# EAGLE schematic ClockGenerator (EAGLE 6.1)
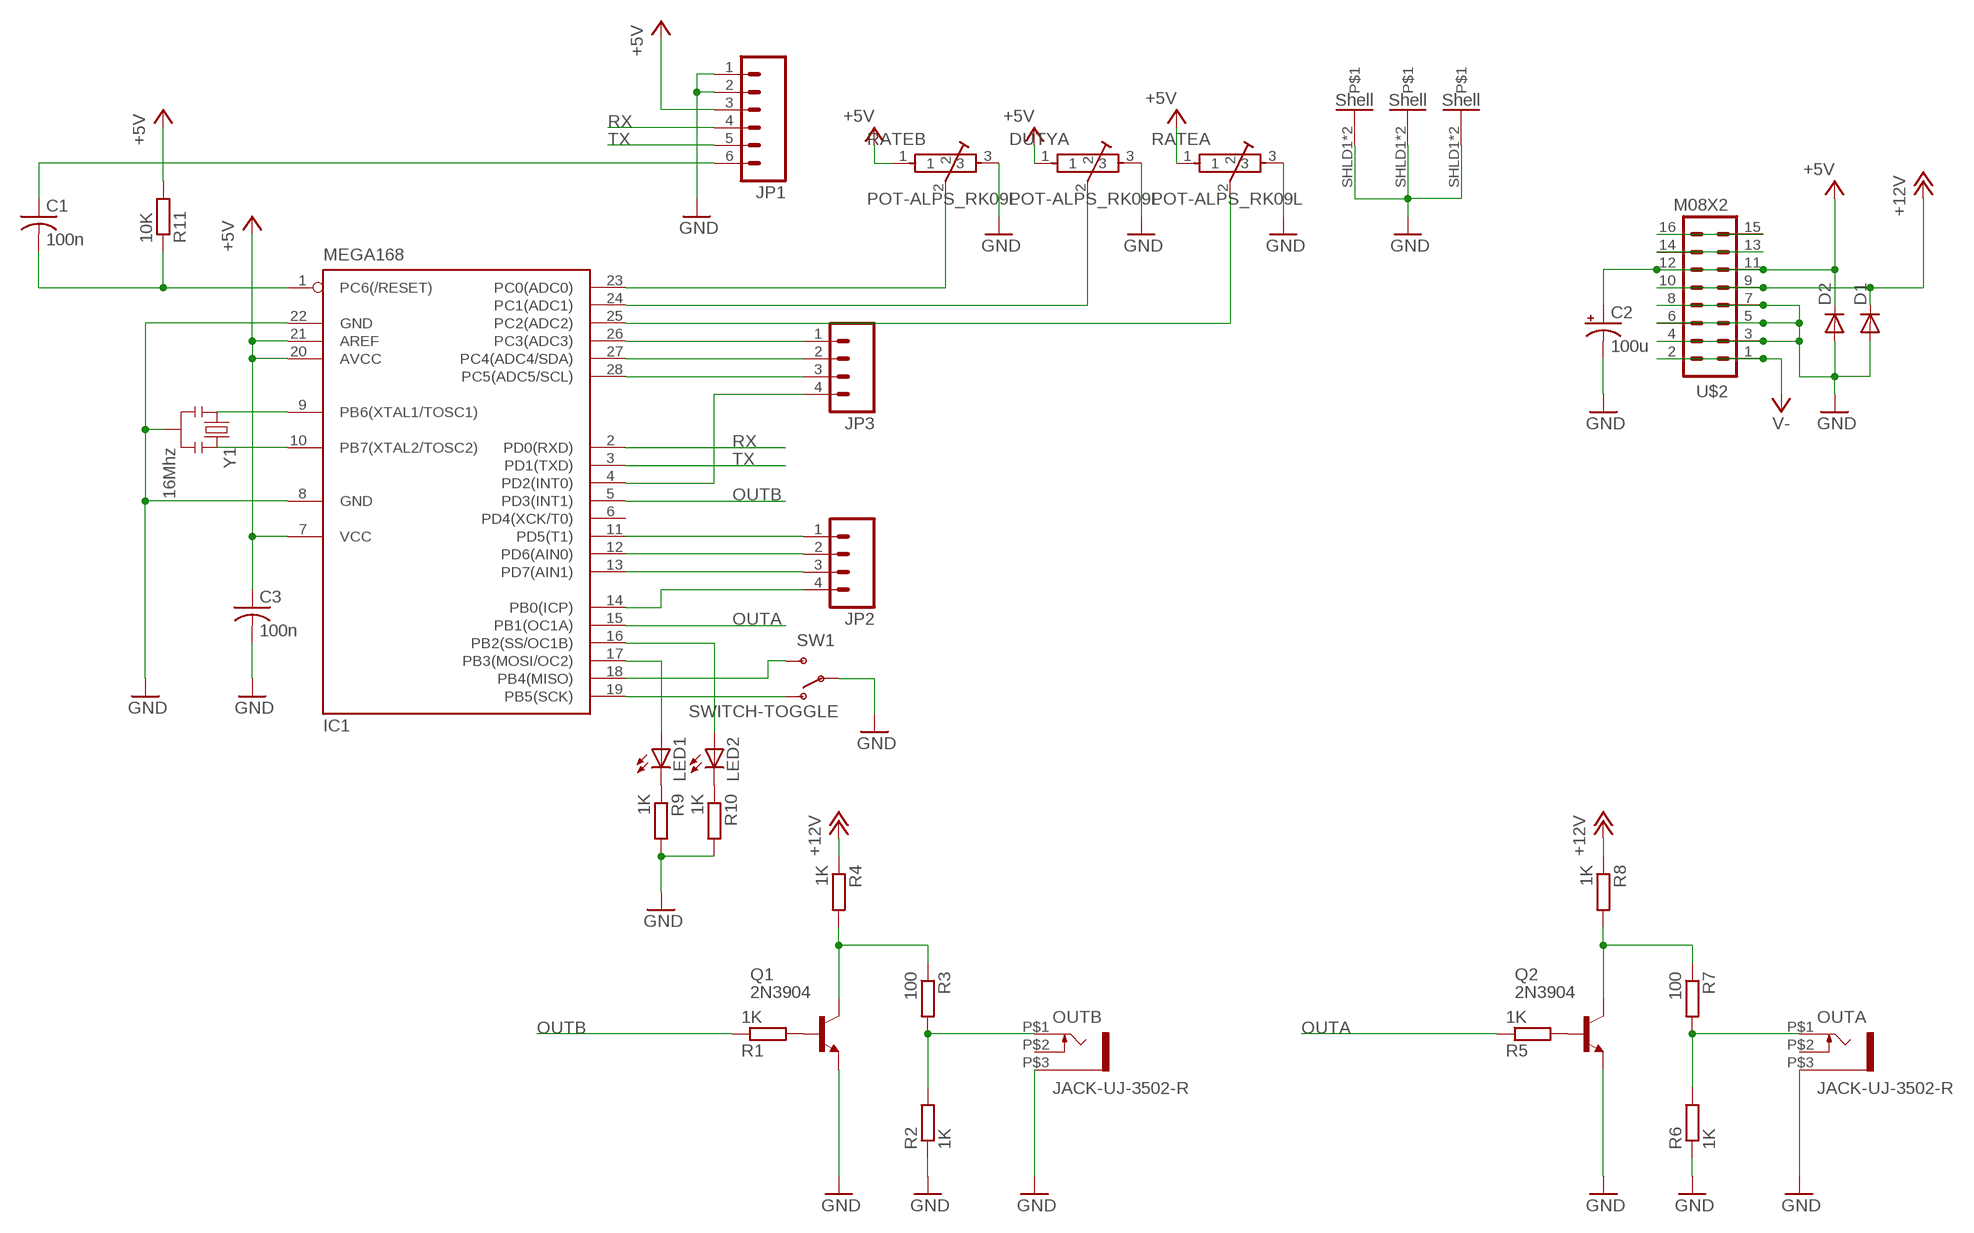
[diagram p0: schematic, sheet 1]

## Parts
C1  100n  C-US050-024X044  [C050-024X044]
C2  100u  CAP_POLPTH1  [CPOL-RADIAL-100UF-25V]
C3  100n  C-US050-024X044  [C050-024X044]
D1  DIODEPTH  [DIODE-1N4001]
D2  DIODEPTH  [DIODE-1N4001]
DUTYA  POT-ALPS_RK09L  [POT-ALPS_RK09L1120]
IC1  MEGA168  MEGA8-P  [DIL28-3]
JP1  M06SIP  [1X06]
JP2  M04PTH  [1X04]
JP3  M04PTH  [1X04]
LED1  LED3MM  [LED3MM]
LED2  LED3MM  [LED3MM]
OUTA  JACK-UJ-3502-R  [UJ-3502-R]
OUTB  JACK-UJ-3502-R  [UJ-3502-R]
Q1  2N3904  [TO92]
Q2  2N3904  [TO92]
R1  1K  R-EU_0204/7  [0204/7]
R2  1K  R-EU_0204/7  [0204/7]
R3  100  R-EU_0204/7  [0204/7]
R4  1K  R-EU_0204/7  [0204/7]
R5  1K  R-EU_0204/7  [0204/7]
R6  1K  R-EU_0204/7  [0204/7]
R7  100  R-EU_0204/7  [0204/7]
R8  1K  R-EU_0204/7  [0204/7]
R9  1K  R-EU_0204/7  [0204/7]
R10  1K  R-EU_0204/7  [0204/7]
R11  10K  R-EU_0204/7  [0204/7]
RATEA  POT-ALPS_RK09L  [POT-ALPS_RK09L1120]
RATEB  POT-ALPS_RK09L  [POT-ALPS_RK09L1120]
SW1  SWITCH-TOGGLE  [SWITCH-SPDT-SALECOM-T8020]
U$2  M08X2  [2X8]
Y1  16Mhz  RESONATORPTH  [RESONATOR-PTH]

## Nets
+5V: C2.1(+) C3.1 D2.C DUTYA.1 IC1.7(VCC) IC1.20(AVCC) IC1.21(AREF) JP1.3 R11.2 RATEA.1 RATEB.1 U$2.11 U$2.12
+12V: D1.C R4.1 R8.1 U$2.9 U$2.10
GND: C2.2(-) C3.2 D1.A D2.A DUTYA.3 DUTYA.SHLD1 DUTYA.SHLD2 IC1.8(GND) IC1.22(GND) JP1.1 JP1.2 OUTA.P$3(SLEEVE) OUTB.P$3(SLEEVE) Q1.3(E) Q2.3(E) R2.1 R6.1 R9.2 R10.2 RATEA.3 RATEA.SHLD1 RATEA.SHLD2 RATEB.3 RATEB.SHLD1 RATEB.SHLD2 SW1.2(P) U$2.3 U$2.4 U$2.5 U$2.6 U$2.7 U$2.8 Y1.2
N$1: IC1.23(PC0(ADC0)) RATEB.2
N$2: DUTYA.2 IC1.24(PC1(ADC1))
N$3: IC1.25(PC2(ADC2)) RATEA.2
N$4: IC1.19(PB5(SCK)) SW1.1(O)
N$5: IC1.11(PD5(T1)) JP2.1
N$6: IC1.16(PB2(SS/OC1B)) LED2.A
N$7: IC1.9(PB6(XTAL1/TOSC1)) Y1.1
N$8: IC1.10(PB7(XTAL2/TOSC2)) Y1.3
N$9: IC1.17(PB3(MOSI/OC2)) LED1.A
N$10: IC1.4(PD2(INT0)) JP3.4
N$11: IC1.28(PC5(ADC5/SCL)) JP3.3
N$12: IC1.27(PC4(ADC4/SDA)) JP3.2
N$13: OUTB.P$1(TIP) R2.2 R3.2
N$14: Q1.1(C) R3.1 R4.2
N$15: IC1.26(PC3(ADC3)) JP3.1
N$16: IC1.12(PD6(AIN0)) JP2.2
N$17: IC1.13(PD7(AIN1)) JP2.3
N$18: U$2.13 U$2.14
N$19: IC1.14(PB0(ICP)) JP2.4
N$20: IC1.18(PB4(MISO)) SW1.3(S)
N$21: Q1.2(B) R1.2
N$25: Q2.2(B) R5.2
N$26: OUTA.P$1(TIP) R6.2 R7.2
N$27: Q2.1(C) R7.1 R8.2
N$28: LED1.K(C) R9.1
N$29: C1.1 JP1.6
N$30: LED2.K(C) R10.1
N$31: C1.2 IC1.1(PC6(/RESET)) R11.1
OUTA: IC1.15(PB1(OC1A)) R5.1
OUTB: IC1.5(PD3(INT1)) R1.1
PWR_BUS: U$2.15 U$2.16
RX: IC1.2(PD0(RXD)) JP1.4
TX: IC1.3(PD1(TXD)) JP1.5
V-: U$2.1 U$2.2
Unconnected: IC1.6(PD4(XCK/T0)) OUTA.P$2(SW) OUTB.P$2(SW) SW1.SHIELD1 SW1.SHIELD2

## Library data of the parts
C1 C3 = rcl:C-US: CAPACITOR, American symbol
C2 = SparkFun:CAP_POL: Capacitor Polarized These are standard SMD and PTH capacitors. Normally 10uF, 47uF, and 100uF in electrolytic and tantalum varieties. Always verify the external diameter of the through hole cap, it varies with capacity, voltage, and manufacturer. The EIA devices should be standard.
D1 D2 = SparkFun:DIODE: Diode These are standard reverse protection diodes and small signal diodes. SMA package can handle up to about 1A. SOD-323 can handle about 200mA. What the SOD-323 package when ordering, there are some mfgs out there that are 5-pin packages.
DUTYA RATEA RATEB = Rebel:POT-ALPS_RK09L
IC1 = atmel:MEGA8-P: MICROCONTROLLER 8 Kbytes FLASH, 1 kbytes SRAM, 512 bytes EEPROM, USART, 4-channel 10 bit ADC, 2-channel 8 bit ADC Pin compatible with Atmega48, ATMega88, ATMega168 Source: avr.lbr; OC_FARNELL: unknown; OC_NEWARK: unknown
JP1 = SparkFun:M06: Header 6 Standard 6-pin 0.1" header. Use with straight break away headers (SKU : PRT-00116), right angle break away headers (PRT-00553), swiss pins (PRT-00743), machine pins (PRT-00117), and female headers (PRT-00115). Molex polarized connector foot print use with SKU : PRT-08094 with associated crimp pins and housings. NOTES ON THE VARIANTS LOCK and LOCK_LONGPADS... This footprint was designed to help hold the alignment of a through-hole component (i.e. 6-pin header) while soldering it into place. You may notice that each hole has been shifted either up or down by 0.005 of an inch from it's more standard position (which is a perfectly straight line). This slight alteration caused the pins (the squares in the middle) to touch the edges of the holes. Because they are alternating, it causes a "brace" to hold the component in place. 0.005 has proven to be the perfect amount of "off-center" position when using our standard breakaway headers. Although looks a little odd when you look at the bare footprint, once you have a header in there, the alteration is very hard to notice. Also, if you push a header all the way into place, it is covered up entirely on the bottom side. This idea of altering the position of holes to aid alignment will be further integrated into the Sparkfun Library for other footprints. It can help hold any component with 3 or more connection pins.
JP2 JP3 = SparkFun:M04: Header 4 Standard 4-pin 0.1" header. Use with straight break away headers (SKU : PRT-00116), right angle break away headers (PRT-00553), swiss pins (PRT-00743), machine pins (PRT-00117), and female headers (PRT-00115). Molex polarized connector foot print use with SKU : PRT-08231 with associated crimp pins and housings. 1MM SMD Version SKU: PRT-10208
LED1 LED2 = SparkFun:LED: LEDs Standard schematic elements and footprints for 5mm, 3mm, 1206, and 0603 sized LEDs. 5mm - Spark Fun Electronics SKU : COM-00529 (and others)
OUTA OUTB = Rebel:JACK-UJ-3502-R
Q1 Q2 = transistor-npn:2N3904: NPN Transistor
R1-R11 = rcl:R-EU_: RESISTOR, European symbol
SW1 = Rebel:SWITCH-TOGGLE: On-off-on toggle switch, right angle, horizontally switched. Salecom TS8020.
U$2 = SparkFun:M08X2
Y1 = SparkFun:RESONATOR: Resonator Small SMD resonator. This is the itty bitty 10/20MHz resonators with built in caps. CSTCE10M0G55 and CSTCE20M0V53. Footprint has been reviewed closely but hasn't been tested yet.